# EAGLE design RelayBoard1 (EAGLE 6.1)
Main relay unit
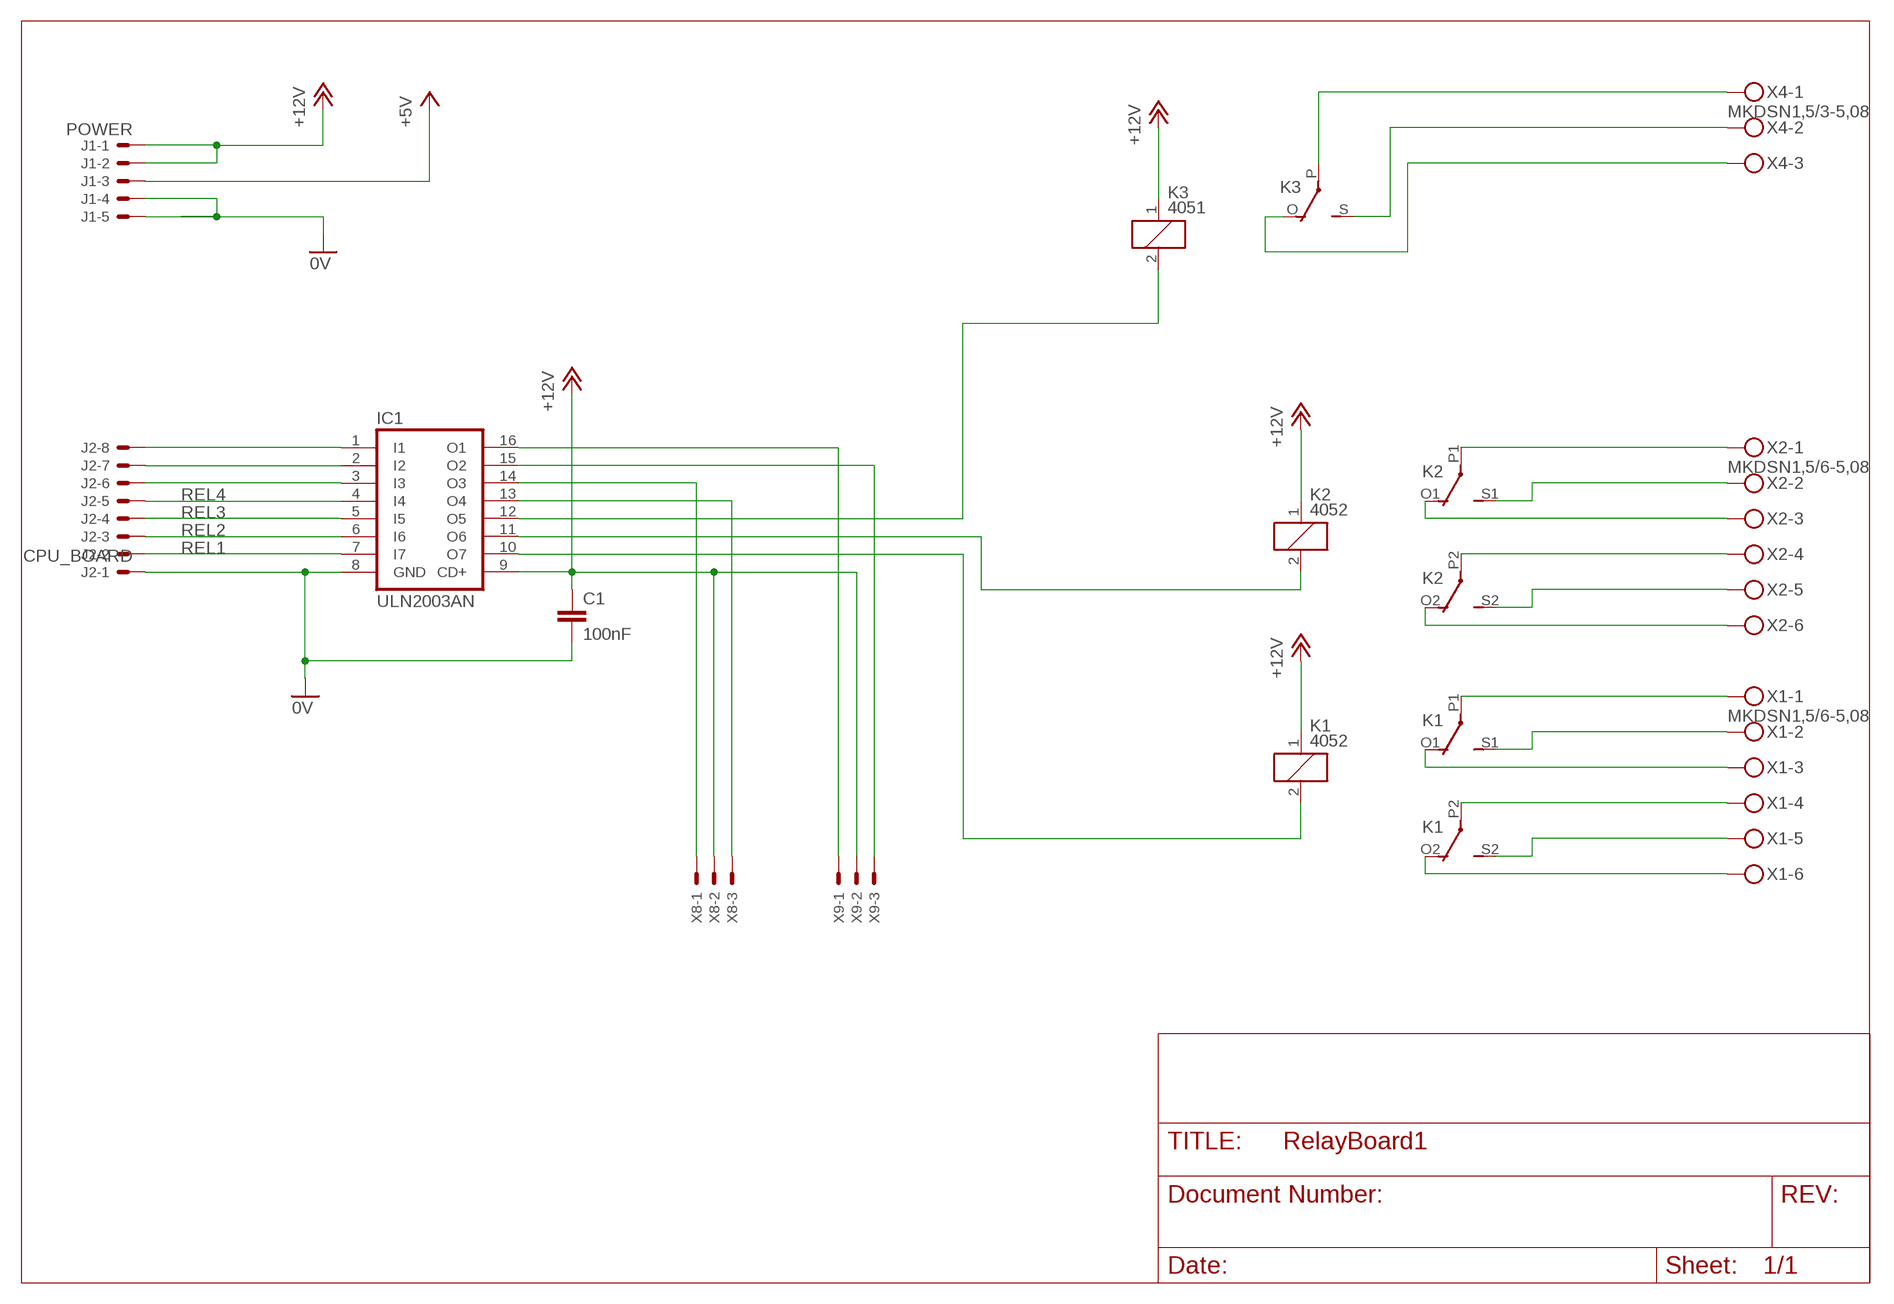
[diagram p0: schematic, sheet 1]

## Parts
C1  100nF  C-EU025-025X050  [C025-025X050]
IC1  ULN2003AN  [DIL16]
J1  POWER  22-27-2051-05  [6410-05]
J2  CPU_BOARD  22-27-2081-08  [6410-08]
K1  4052  [F4052]
K2  4052  [F4052]
K3  4051  G2R  [G2R]
X1  MKDSN1,5/6-5,08  [MKDSN1,5/6-5,08]
X2  MKDSN1,5/6-5,08  [MKDSN1,5/6-5,08]
X4  MKDSN1,5/3-5,08  [MKDSN1,5/3-5,08]
X8  KK-156-3  [KK-156-3]
X9  KK-156-3  [KK-156-3]

## Nets
0V: C1.2 IC1.8(GND) J1.4 J1.5 J2.1
+5V: J1.3
+12V: C1.1 IC1.9(CD+) J1.1 J1.2 K1.1 K2.1 K3.1 X8.2 X9.2
N$1: K3.P(2:P) X4.1
N$2: K3.S(2:S) X4.2
N$3: K3.O(2:O) X4.3
N$4: IC1.10(O7) K1.2
N$6: K2.P1(2:P) X2.1
N$7: K2.S1(2:S) X2.2
N$8: K2.O1(2:O) X2.3
N$9: K2.P2(3:P) X2.4
N$10: K2.S2(3:S) X2.5
N$11: K2.O2(3:O) X2.6
N$12: K1.P1(2:P) X1.1
N$13: K1.S1(2:S) X1.2
N$14: K1.O1(2:O) X1.3
N$15: K1.P2(3:P) X1.4
N$16: K1.S2(3:S) X1.5
N$17: K1.O2(3:O) X1.6
N$21: IC1.3(I3) J2.6
N$22: IC1.2(I2) J2.7
N$23: IC1.1(I1) J2.8
N$25: IC1.11(O6) K2.2
N$26: IC1.12(O5) K3.2
N$27: IC1.14(O3) X8.1
N$28: IC1.13(O4) X8.3
N$29: IC1.16(O1) X9.1
N$30: IC1.15(O2) X9.3
REL1: IC1.7(I7) J2.2
REL2: IC1.6(I6) J2.3
REL3: IC1.5(I5) J2.4
REL4: IC1.4(I4) J2.5

## Library data of the parts
C1 = resistor:C-EU: CAPACITOR, European symbol
IC1 = uln-udn:ULN2003A: DRIVER ARRAY
J1 = con-molex:22-?-05: CONNECTOR wire to board 2.54 mm (.1 inch) pitch header; OC_FARNELL: unknown; OC_NEWARK: unknown
J2 = con-molex:22-?-08: CONNECTOR wire to board 2.54 mm (.1 inch) pitch header; OC_FARNELL: unknown; OC_NEWARK: unknown
K1 K2 = relay:4052: RELAY 2 x switch, Finder; OC_FARNELL: unknown; OC_NEWARK: unknown
K3 = relay:G2R: RELAY 1 x switch, Omron; OC_FARNELL: 1569185; OC_NEWARK: unknown
X1 X2 = con-phoenix-508:MKDSN1,5/6-5,08: MKDSN 1,5/ 6-5,08 Printklemme Nennstrom: 13,5 A Nennspannung: 250 V Rastermaß: 5,08 mm Polzahl: 6 Anschlussart: Schraubanschluss Montage: Löten Anschlussrichtung Leiter/Platine: 0 ° Artikelnummer: 1729160 Source: http://eshop.phoenixcontact.com .. 1729160.pdf; MPN: SMKDSN1,5/6-5,08; OC_FARNELL: 1792907; OC_NEWARK: 70R0302
X4 = con-phoenix-508:MKDSN1,5/3-5,08: MKDSN 1,5/ 3-5,08 Printklemme Nennstrom: 13,5 A Nennspannung: 250 V Rastermaß: 5,08 mm Polzahl: 3 Anschlussart: Schraubanschluss Montage: Löten Anschlussrichtung Leiter/Platine: 0 ° Artikelnummer: 1729131 Source: http://eshop.phoenixcontact.com .. 1729131.pdf; MPN: SMKDSN1,5/3-5,08; OC_FARNELL: 1792904; OC_NEWARK: 70R0299
X8 X9 = con-molex:KK-156-3: KK 156 HEADER Source: http://www.molex.com/pdm_docs/sd/026604100_sd.pdf; OC_FARNELL: unknown; OC_NEWARK: unknown

## Board
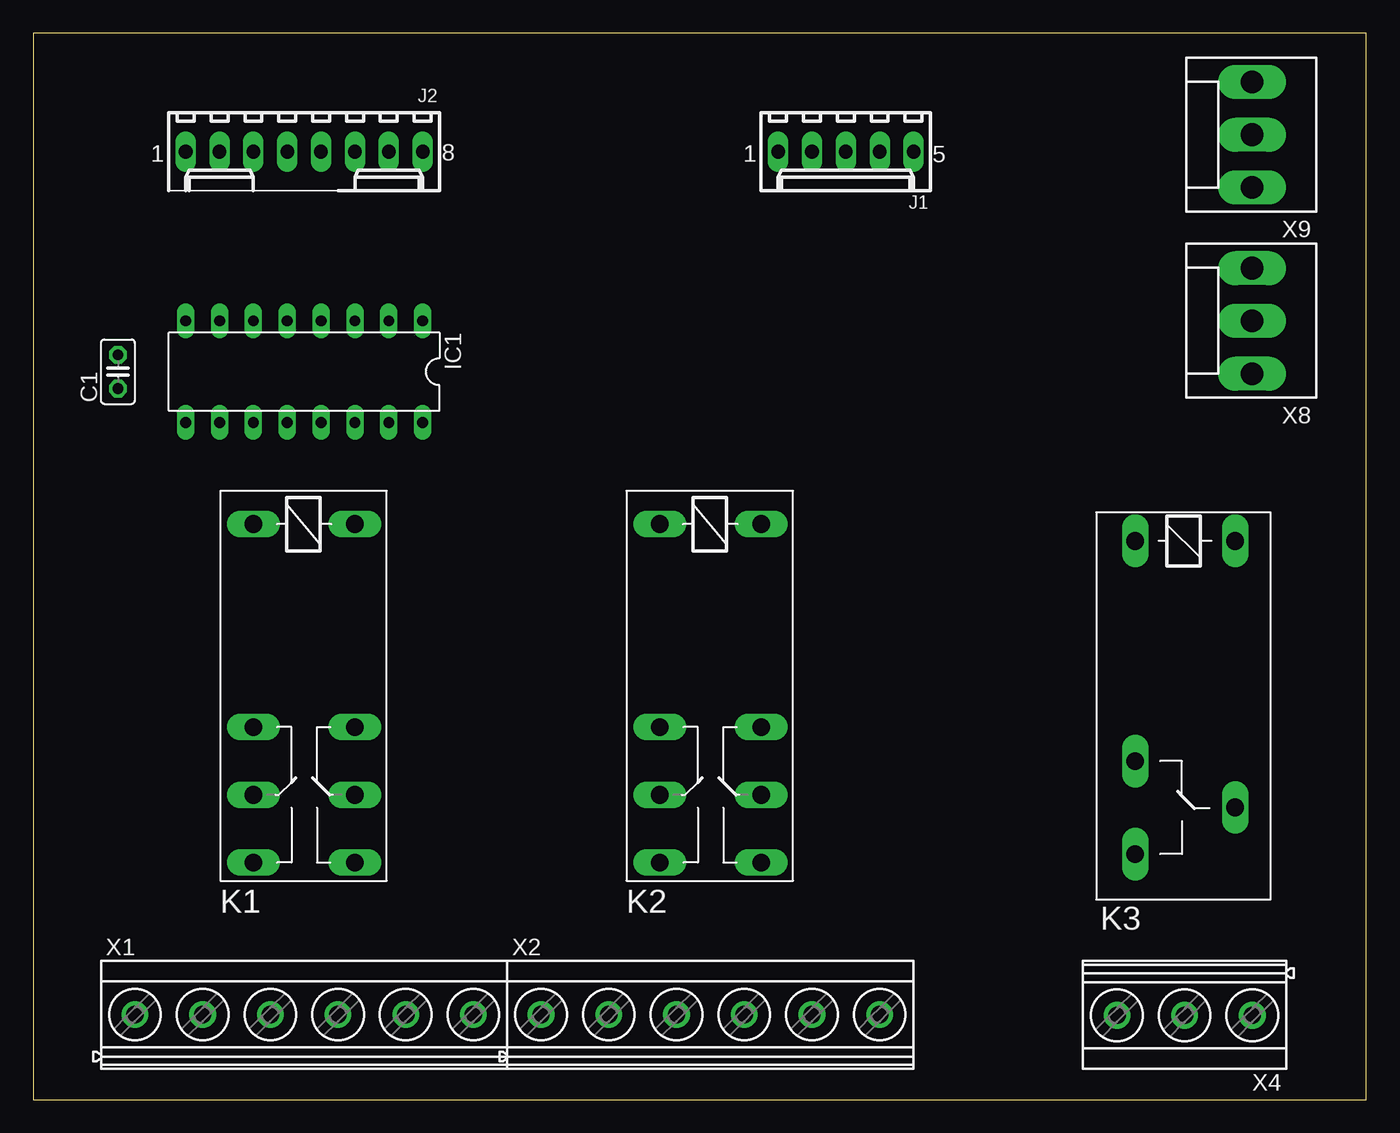
[diagram p1: board, top side]
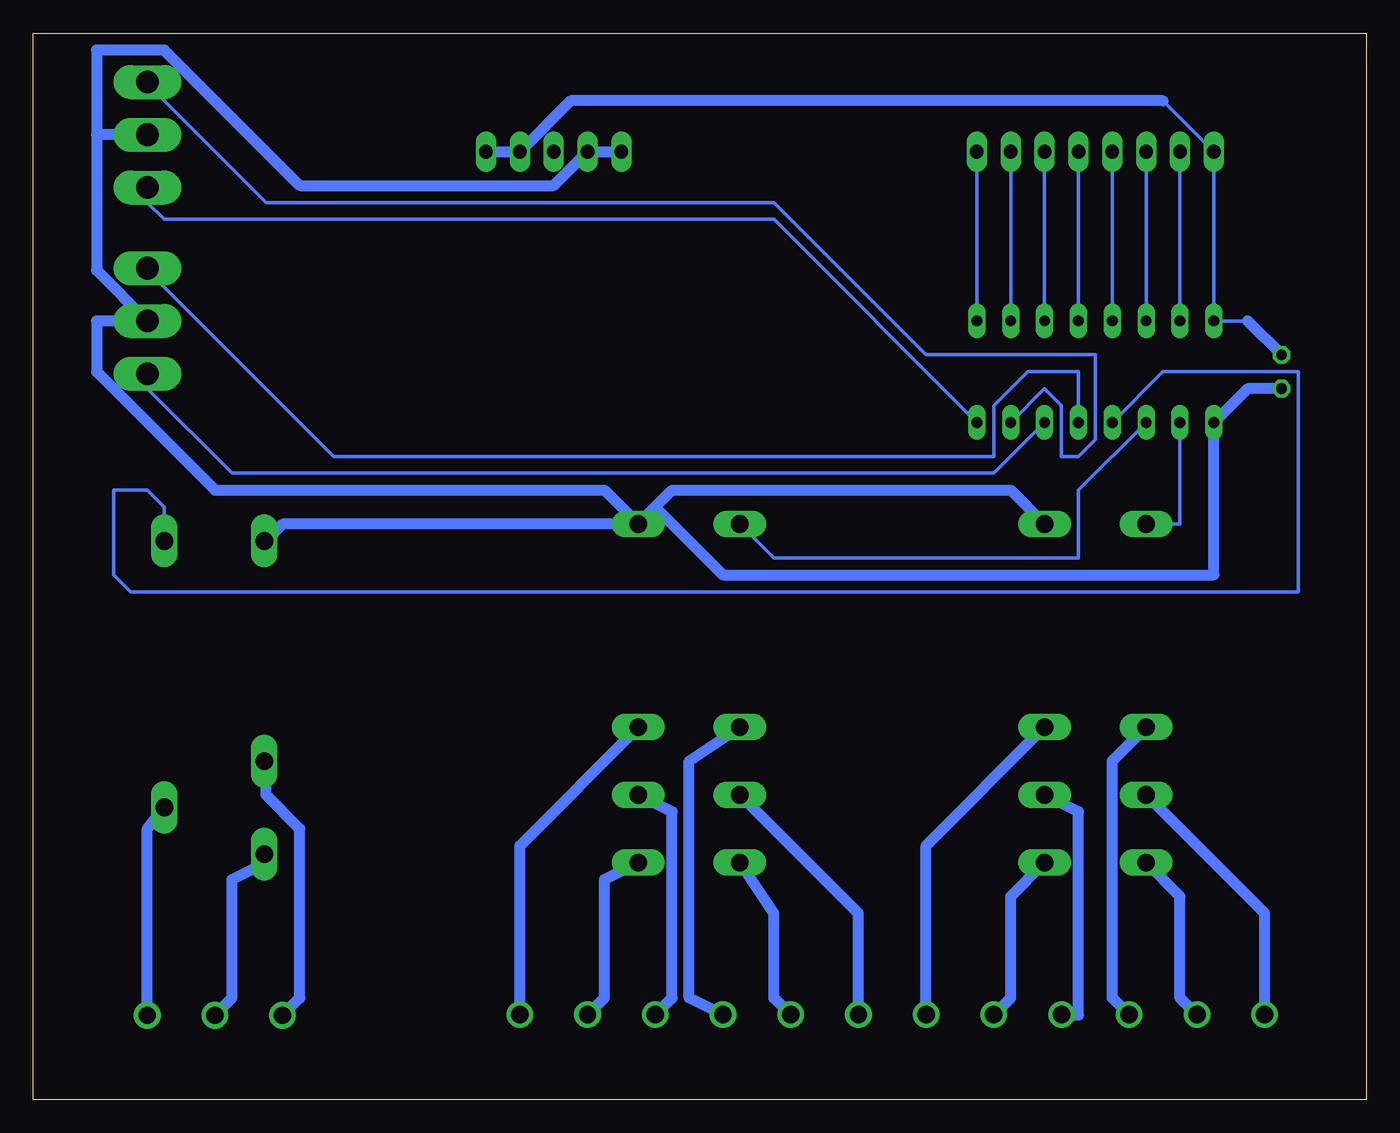
[diagram p2: board, bottom side, seen from below]

Size 100 x 80 mm. Coordinates in mm from the lower left corner, seen from the top.
Outline: 0,0 100,0 100,80 0,80 0,0
Copper layers (1*16): Top 0.035mm / dielectric 1.5mm / Bottom 0.035mm
Design rules: minimum track width 10mil, minimum drill 24mil, track to track 8mil, track to pad 8mil, pad to pad 8mil, via to via 8mil, smd to smd 8mil, copper to edge 40mil, drill to drill 8mil, minimum pad ring 10mil, minimum via ring 8mil, stop-mask expansion 4mil, vias tented up to drill 0mil, thermal gap 10mil

### Footprints (pad centres in the part's own frame; a part is rotated, then mirrored left to right if it is on the bottom)
C025-025X050 = drill 0.813 octagon: 1 -1.27,0; 2 1.27,0
DIL16 = drill 0.813 long: 1 -8.89,-3.81; 2 -6.35,-3.81; 3 -3.81,-3.81; 4 -1.27,-3.81; 5 1.27,-3.81; 6 3.81,-3.81; 7 6.35,-3.81; 8 8.89,-3.81; 9 8.89,3.81; 10 6.35,3.81; 11 3.81,3.81; 12 1.27,3.81; 13 -1.27,3.81; 14 -3.81,3.81; 15 -6.35,3.81; 16 -8.89,3.81
6410-05 = drill 1.016 long: 1 5.08,0; 2 2.54,0; 3 0,0; 4 -2.54,0; 5 -5.08,0
6410-08 = drill 1.016 long: 1 8.89,0; 2 6.35,0; 3 3.81,0; 4 1.27,0; 5 -1.27,0; 6 -3.81,0; 7 -6.35,0; 8 -8.89,0
F4052 = drill 1.321 long: 1 -3.81,3.81; 2 -3.81,-3.81; O1 11.43,-3.81; O2 11.43,3.81; P1 16.51,-3.81; P2 16.51,3.81; S1 21.59,-3.81; S2 21.59,3.81
G2R = drill 1.321 long: 1 -2.54,-3.683; 2 -2.54,3.81; O 13.97,-3.683; P 17.45,3.81; S 20.955,-3.683
MKDSN1,5/6-5,08 = drill 1.3 pad 2: 1 -12.7,0.025; 2 -7.62,0.025; 3 -2.54,0.025; 4 2.54,0.025; 5 7.62,0.025; 6 12.7,0.025
MKDSN1,5/3-5,08 = drill 1.3 pad 2: 1 -7.641,0.025; 2 -2.561,0.025; 3 2.519,0.025
KK-156-3 = drill 1.7 pad 2.184 long: 1 -3.96,0; 2 0,0; 3 3.96,0

### Placement (x,y rotation side)
C1  6.35,54.61 90 top
IC1  20.32,54.61 180 top
J1  60.96,71.12 180 top
J2  20.32,71.12 180 top
K1  20.32,39.37 270 top
K2  50.8,39.37 270 top
K3  86.36,39.37 270 top
X1  20.32,6.35 0 top
X2  50.8,6.35 0 top
X4  83.82,6.35 180 top
X8  91.44,58.42 90 top
X9  91.44,72.39 90 top

### Tracks (layer width: path | path; a pad name or v marks a point on that pad's centre or on a via)
0V
  Bottom 0.254: 8.89,58.42 IC1.8 J2.1 15.24,74.93
  Bottom 0.813: J1.5 J1.4 59.69,74.93 15.24,74.93 | 8.89,58.42 C1.2
+12V
  Top 0.254: 82.55,41.91 K3.1
  Bottom 0.254: 82.55,41.91 K3.1
  Bottom 0.813: J1.1 J1.2 60.96,68.58 80.01,68.58 90.17,78.74 95.25,78.74 95.25,72.39 | C1.1 8.89,53.34 IC1.9 11.43,39.37 48.26,39.37 53.34,44.45 | K1.1 26.67,45.72 52.07,45.72 53.34,44.45 | K2.1 53.34,44.45 | 82.55,41.91 81.28,43.18 K2.1 | 95.25,72.39 95.25,62.23 X8.2 95.25,58.42 95.25,54.61 86.36,45.72 57.15,45.72 K2.1 | X9.2 95.25,72.39
N$1
  Top 0.254: 91.44,6.35 X4.1
  Bottom 0.254: 91.44,6.35 X4.1
  Bottom 0.813: K3.P 91.44,20.32 91.44,6.35
N$2
  Top 0.254: 86.36,6.35 X4.2
  Bottom 0.254: 82.55,17.78 K3.S | 86.36,6.35 X4.2
  Bottom 0.813: 82.55,17.78 85.09,16.51 85.09,7.62 86.36,6.35
N$3
  Top 0.254: 82.55,25.4 K3.O | 81.28,6.35 X4.3
  Bottom 0.254: 82.55,25.4 K3.O
  Bottom 0.813: 82.55,25.4 82.55,22.86 80.01,20.32 80.01,7.62 X4.3
N$4
  Bottom 0.254: IC1.10 13.97,43.18 K1.2
N$6
  Top 0.254: 38.1,6.35 X2.1
  Bottom 0.254: 38.1,6.35 X2.1
  Bottom 0.813: K2.P1 38.1,13.97 X2.1
N$7
  Top 0.254: 43.18,6.35 X2.2
  Bottom 0.254: 43.18,6.35 X2.2
  Bottom 0.813: K2.S1 44.45,13.97 44.45,7.62 43.18,6.35
N$8
  Top 0.254: 48.26,6.35 X2.3
  Bottom 0.254: 48.26,6.35 X2.3
  Bottom 0.813: K2.O1 50.8,25.4 50.8,7.62 48.26,6.35
N$9
  Top 0.254: 53.34,6.35 X2.4
  Bottom 0.254: 53.34,6.35 X2.4
  Bottom 0.813: K2.P2 52.07,21.59 52.07,7.62 53.34,6.35
N$10
  Top 0.254: 58.42,6.35 X2.5
  Bottom 0.254: 58.42,6.35 X2.5
  Bottom 0.813: K2.S2 57.15,16.51 57.15,7.62 58.42,6.35
N$11
  Top 0.254: 63.5,6.35 X2.6
  Bottom 0.254: 63.5,6.35 X2.6
  Bottom 0.813: K2.O2 63.5,19.05 X2.6
N$12
  Top 0.254: 7.62,6.35 X1.1
  Bottom 0.254: 7.62,6.35 X1.1
  Bottom 0.813: K1.P1 7.62,13.97 X1.1
N$13
  Top 0.254: 12.7,6.35 X1.2
  Bottom 0.254: 12.7,6.35 X1.2
  Bottom 0.813: K1.S1 13.97,15.24 13.97,7.62 12.7,6.35
N$14
  Top 0.254: 17.78,6.35 X1.3
  Bottom 0.254: 17.78,6.35 X1.3
  Bottom 0.813: K1.O1 19.05,25.4 19.05,7.62 17.78,6.35
N$15
  Top 0.254: 22.86,6.35 X1.4
  Bottom 0.254: 22.86,6.35 X1.4
  Bottom 0.813: K1.P2 21.59,21.59 21.59,6.35 22.86,6.35
N$16
  Top 0.254: 27.94,6.35 X1.5
  Bottom 0.813: K1.S2 26.67,15.24 26.67,7.62 27.94,6.35
  Bottom 1.27: 27.94,6.35 X1.5
N$17
  Top 0.254: 33.02,6.35 X1.6
  Bottom 0.254: 33.02,6.35 X1.6
  Bottom 0.813: K1.O2 33.02,19.05 X1.6
N$21
  Bottom 0.254: J2.6 IC1.3
N$22
  Bottom 0.254: J2.7 IC1.2
N$23
  Bottom 0.254: J2.8 IC1.1
N$25
  Bottom 0.254: IC1.11 21.59,45.72 21.59,40.64 44.45,40.64 K2.2
N$26
  Bottom 0.254: IC1.12 15.24,54.61 5.08,54.61 5.08,38.1 92.71,38.1 93.98,39.37 93.98,45.72 91.44,45.72 90.17,44.45 K3.2
N$27
  Bottom 0.254: IC1.14 27.94,46.99 85.09,46.99 91.44,53.34 X8.1
N$28
  Bottom 0.254: IC1.13 21.59,54.61 25.4,54.61 27.94,52.07 27.94,48.26 77.47,48.26 91.44,62.23 X8.3
N$29
  Bottom 0.254: IC1.16 44.45,66.04 90.17,66.04 91.44,67.31 X9.1
N$30
  Bottom 0.254: IC1.15 24.13,53.34 22.86,52.07 22.86,48.26 21.59,48.26 20.32,49.53 20.32,55.88 33.02,55.88 44.45,67.31 82.55,67.31 91.44,76.2 X9.3
REL1
  Bottom 0.254: J2.2 IC1.7
REL2
  Bottom 0.254: J2.3 IC1.6
REL3
  Bottom 0.254: J2.4 IC1.5
REL4
  Bottom 0.254: J2.5 IC1.4